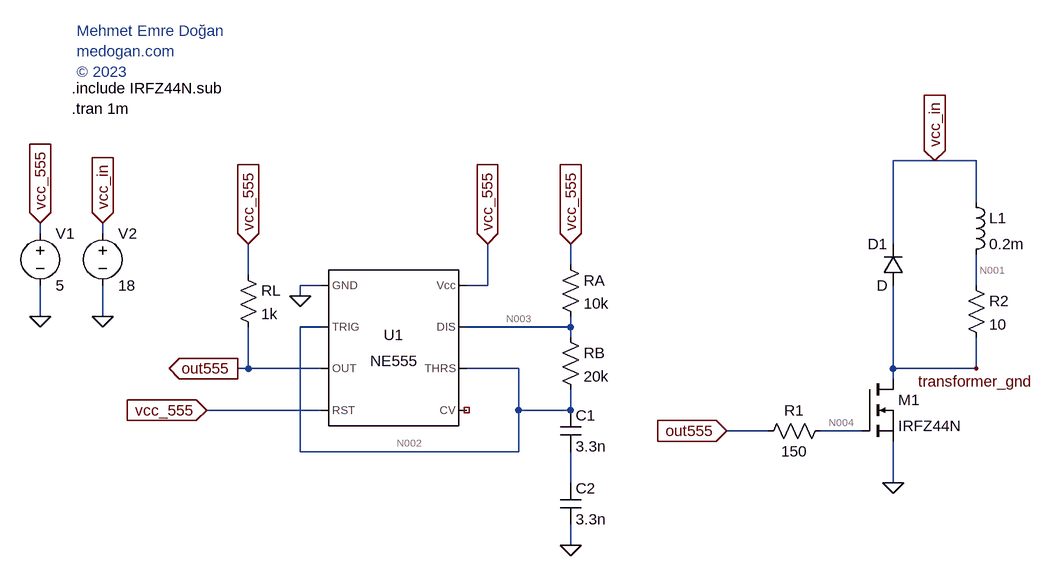
[diagram p0: schematic 555vibrator_10k_20k_withMosExperimental.asc]
555vibrator_10k_20k_withMosExperimental.asc, the LTspice schematic file:
Version 4
SHEET 1 1392 680
WIRE 1072 -112 1008 -112
WIRE 1136 -112 1072 -112
WIRE 1136 -48 1136 -112
WIRE -304 0 -304 -16
WIRE -208 0 -208 -16
WIRE 1008 16 1008 -112
WIRE 512 48 512 16
WIRE 16 64 16 16
WIRE 128 80 96 80
WIRE 384 80 384 16
WIRE 384 80 352 80
WIRE 1136 80 1136 32
WIRE 96 96 96 80
WIRE -304 128 -304 80
WIRE -208 128 -208 80
WIRE 128 144 96 144
WIRE 512 144 512 128
WIRE 512 144 352 144
WIRE 512 160 512 144
WIRE 16 208 16 144
WIRE 16 208 0 208
WIRE 128 208 16 208
WIRE 432 208 352 208
WIRE 1008 208 1008 80
WIRE 1136 208 1136 160
WIRE 1136 208 1008 208
WIRE 1008 224 1008 208
WIRE 128 272 -48 272
WIRE 432 272 432 208
WIRE 512 272 512 240
WIRE 512 272 432 272
WIRE 816 304 752 304
WIRE 960 304 896 304
WIRE 96 336 96 144
WIRE 432 336 432 272
WIRE 432 336 96 336
WIRE 512 384 512 336
WIRE 1008 384 1008 320
WIRE 512 480 512 448
FLAG -304 128 0
FLAG -304 -16 vcc_555
IOPIN -304 -16 In
FLAG 96 96 0
FLAG 384 16 vcc_555
IOPIN 384 16 In
FLAG 16 16 vcc_555
IOPIN 16 16 In
FLAG 0 208 out555
IOPIN 0 208 Out
FLAG -48 272 vcc_555
IOPIN -48 272 In
FLAG 512 480 0
FLAG 512 16 vcc_555
IOPIN 512 16 In
FLAG 1008 384 0
FLAG 752 304 out555
IOPIN 752 304 In
FLAG 1072 -112 vcc_in
IOPIN 1072 -112 In
FLAG -208 128 0
FLAG -208 -16 vcc_in
IOPIN -208 -16 In
FLAG 1136 208 transformer_gnd
SYMBOL Misc\\NE555 240 176 R0
SYMATTR InstName U1
SYMBOL voltage -304 -16 R0
SYMATTR InstName V1
SYMATTR Value 5
SYMBOL res 0 48 R0
SYMATTR InstName RL
SYMATTR Value 1k
SYMBOL res 496 32 R0
SYMATTR InstName RA
SYMATTR Value 10k
SYMBOL res 496 144 R0
SYMATTR InstName RB
SYMATTR Value 20k
SYMBOL cap 496 272 R0
SYMATTR InstName C1
SYMATTR Value 3.3n
SYMBOL nmos 960 224 R0
SYMATTR InstName M1
SYMATTR Value IRFZ44N
SYMBOL diode 1024 80 R180
WINDOW 0 24 64 Left 2
WINDOW 3 24 0 Left 2
SYMATTR InstName D1
SYMBOL voltage -208 -16 R0
SYMATTR InstName V2
SYMATTR Value 18
SYMBOL res 912 288 R90
WINDOW 0 0 56 VBottom 2
WINDOW 3 32 56 VTop 2
SYMATTR InstName R1
SYMATTR Value 150
SYMBOL res 1120 64 R0
SYMATTR InstName R2
SYMATTR Value 10
SYMBOL ind 1120 -64 R0
SYMATTR InstName L1
SYMATTR Value 0.2m
SYMBOL cap 496 384 R0
SYMATTR InstName C2
SYMATTR Value 3.3n
TEXT -248 -312 Left 2 ;Mehmet Emre Doğan\nmedogan.com \n© 2023
TEXT -256 -192 Left 2 !.tran 1m
TEXT -256 -224 Left 2 !.include IRFZ44N.sub

The netlist it stands for:
* 555vibrator_10k_20k_withMosExperimental.asc
XU1 0 N002 out555 vcc_555 NC_01 N002 N003 vcc_555 NE555  ; pins GND TRIG OUT RST CV THRS DIS Vcc
V1 vcc_555 0 5
RL vcc_555 out555 1k
RA vcc_555 N003 10k
RB N003 N002 20k
C1 N002 N005 3.3n
M1 transformer_gnd N004 0 0 IRFZ44N
D1 transformer_gnd vcc_in D
V2 vcc_in 0 18
R1 N004 out555 150
R2 N001 transformer_gnd 10
L1 vcc_in N001 0.2m
C2 N005 0 3.3n
.model D D
.lib standard.dio
.model NMOS NMOS
.model PMOS PMOS
.lib standard.mos
* Mehmet Emre Doğan
* medogan.com
* © 2023
.tran 1m
.include IRFZ44N.sub
.lib NE555.sub
.backanno
.end

* Results of the author's LTspice run, read from the files saved beside the schematic
* Operating Point, zero values left out:
*   V(n002) = 5 V
*   V(vcc_555) = 5 V
*   V(n003) = 5 V
*   V(out555) = 5 V
*   V(transformer_gnd) = 108 mV
*   V(n004) = 5 V
*   V(vcc_in) = 18 V
*   V(n001) = 18 V
*   Id(M1) = 1.789 A
*   Is(M1) = -1.789 A
*   I(D1) = -17.9 pA
*   I(L1) = 1.789 A
*   I(R2) = 1.789 A
*   I(Rb) = 9.999 nA
*   I(Ra) = 16.67 nA
*   I(Rl) = 29.82 nA
*   I(V2) = -1.789 A
*   I(V1) = -1.611 mA
*   Ix(u1:1) = -1.611 mA
*   Ix(u1:2) = 5 nA
*   Ix(u1:3) = 29.82 nA
*   Ix(u1:4) = 22.67 µA
*   Ix(u1:6) = 5 nA
*   Ix(u1:7) = 6.671 nA
*   Ix(u1:8) = 1.588 mA
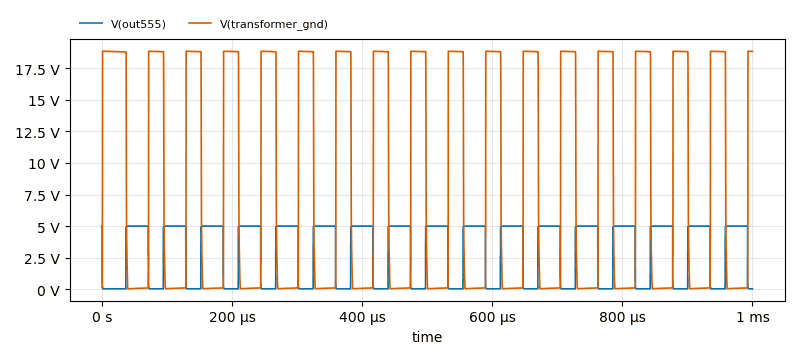
[diagram p1: Transient Analysis of 555vibrator_10k_20k_withMosExperimental.asc, plotted from the saved traces]
* Transient Analysis, 1 run:
*   V(out555): min 29.84 mV, max 5 V, average 2.944 V, rms 3.825 V, last 29.85 mV
*   V(transformer_gnd): min 27.74 mV, max 18.85 V, average 8.007 V, rms 12.16 V, last 18.84 V